# Altium schematic sheet GPIO.SchDoc
size A4; SheetNumber: 6; SheetTotal: 6
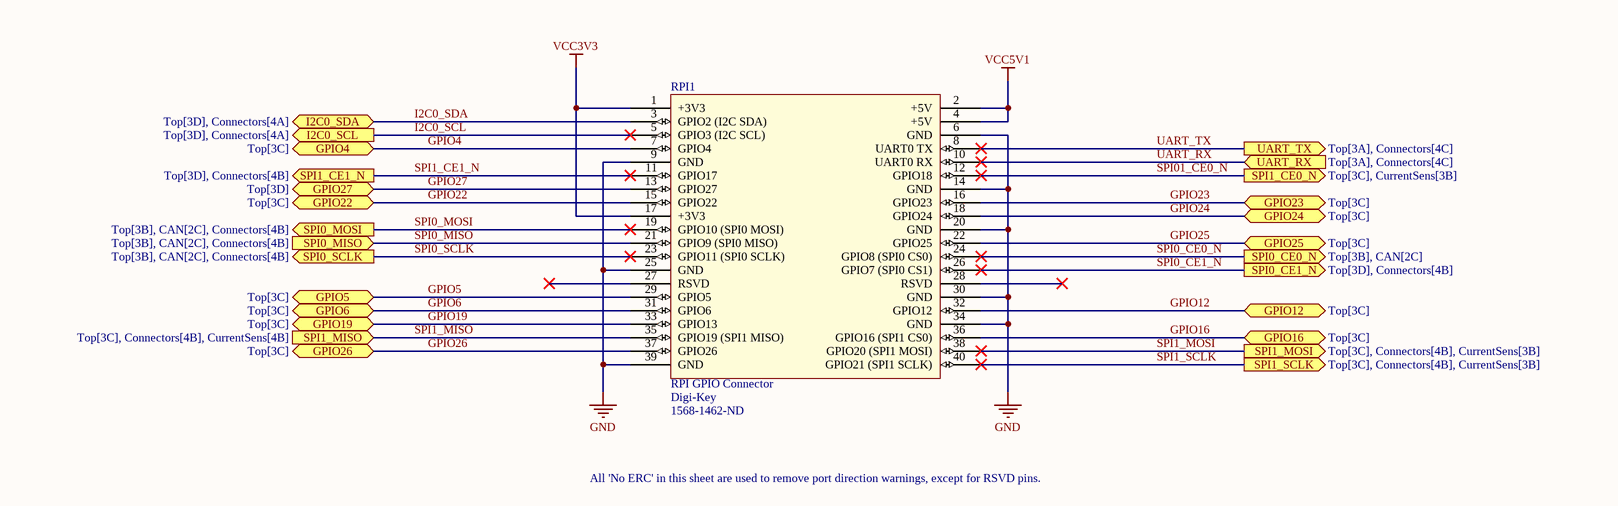
[diagram p0: GPIO.SchDoc]

## Parts
RPI1  RPI GPIO Connector  Supplier 1: Digi-Key  Supplier Part Number 1: 1568-1462-ND  [rpi]

## Ports
GPIO4 (bidir, see Top[3C]), GPIO5 (bidir, see Top[3C]), GPIO6 (bidir, see Top[3C]), GPIO12 (bidir, see Top[3C]), GPIO16 (bidir, see Top[3C]), GPIO19 (bidir, see Top[3C]), GPIO22 (bidir, see Top[3C]), GPIO23 (bidir, see Top[3C]), GPIO24 (bidir, see Top[3C]), GPIO25 (bidir, see Top[3C]), GPIO26 (bidir, see Top[3C]), GPIO27 (bidir, see Top[3D]), I2C0_SCL (out, see Top[3D], Connectors[4A]), I2C0_SDA (bidir, see Top[3D], Connectors[4A]), SPI0_CE0_N (out, see Top[3B], CAN[2C]), SPI0_CE1_N (out, see Top[3D], Connectors[4B]), SPI0_MISO (in, see Top[3B], CAN[2C], Connectors[4B]), SPI0_MOSI (out, see Top[3B], CAN[2C], Connectors[4B]), SPI0_SCLK (out, see Top[3B], CAN[2C], Connectors[4B]), SPI1_CE0_N (out, see Top[3C], CurrentSens[3B]), SPI1_CE1_N (out, see Top[3D], Connectors[4B]), SPI1_MISO (in, see Top[3C], Connectors[4B], CurrentSens[4B]), SPI1_MOSI (out, see Top[3C], Connectors[4B], CurrentSens[3B]), SPI1_SCLK (out, see Top[3C], Connectors[4B], CurrentSens[3B]), UART_RX (in, see Top[3A], Connectors[4C]), UART_TX (out, see Top[3A], Connectors[4C])

## Nets
GND: RPI1.6(GND) RPI1.9(GND) RPI1.14(GND) RPI1.20(GND) RPI1.25(GND) RPI1.30(GND) RPI1.34(GND) RPI1.39(GND)
VCC3V3: RPI1.1(+3V3) RPI1.17(+3V3)
VCC5V1: RPI1.2(+5V) RPI1.4(+5V)
GPIO4: RPI1.7(GPIO4) ; port GPIO4
GPIO5: RPI1.29(GPIO5) ; port GPIO5
GPIO6: RPI1.31(GPIO6) ; port GPIO6
GPIO12: RPI1.32(GPIO12) ; port GPIO12
GPIO16: RPI1.36(GPIO16_(SPI1_CS0)) ; port GPIO16
GPIO19: RPI1.33(GPIO13) ; port GPIO19
GPIO22: RPI1.15(GPIO22) ; port GPIO22
GPIO23: RPI1.16(GPIO23) ; port GPIO23
GPIO24: RPI1.18(GPIO24) ; port GPIO24
GPIO25: RPI1.22(GPIO25) ; port GPIO25
GPIO26: RPI1.37(GPIO26) ; port GPIO26
GPIO27: RPI1.13(GPIO27) ; port GPIO27
I2C0_SCL: RPI1.5(GPIO3_(I2C_SCL)) ; port I2C0_SCL
I2C0_SDA: RPI1.3(GPIO2_(I2C_SDA)) ; port I2C0_SDA
SPI0_CE0_N: RPI1.24(GPIO8_(SPI0_CS0)) ; port SPI0_CE0_N
SPI0_CE1_N: RPI1.26(GPIO7_(SPI0_CS1)) ; port SPI0_CE1_N
SPI0_MISO: RPI1.21(GPIO9_(SPI0_MISO)) ; port SPI0_MISO
SPI0_MOSI: RPI1.19(GPIO10_(SPI0_MOSI)) ; port SPI0_MOSI
SPI0_SCLK: RPI1.23(GPIO11_(SPI0_SCLK)) ; port SPI0_SCLK
SPI01_CE0_N: RPI1.12(GPIO18) ; port SPI1_CE0_N
SPI1_CE1_N: RPI1.11(GPIO17) ; port SPI1_CE1_N
SPI1_MISO: RPI1.35(GPIO19_(SPI1_MISO)) ; port SPI1_MISO
SPI1_MOSI: RPI1.38(GPIO20_(SPI1_MOSI)) ; port SPI1_MOSI
SPI1_SCLK: RPI1.40(GPIO21_(SPI1_SCLK)) ; port SPI1_SCLK
UART_RX: RPI1.10(UART0_RX) ; port UART_RX
UART_TX: RPI1.8(UART0_TX) ; port UART_TX

Not connected (* = marked no-connect by the designer): RPI1 27(RSVD)* 28(RSVD)*

## Notes on the sheet
- All 'No ERC' in this sheet are used to remove port direction warnings, except for RSVD pins.

## Library data of the parts
RPI1 = rpi connector: GPIO Header for Raspberry Pi A+/B+/Pi 2/Pi 3 - 2x20; Manufacturer: SparkFun Electronics; Manufacturer Part Number: PRT-14017; Nils Minor: author; nilsminor@web.de: mail; RoHS: RoHS Compliant; Category: Development Boards, Kits, Programmers; Stock 1: 150; Pricing 1: 1=1.84 (EUR); Part Status: Active; Accessory Type: Connector; For Use With/Related Products: Raspberry Pi; ComponentLink1URL: https://cdn.sparkfun.com/datasheets/Dev/RaspberryPi/12313.pdf; ComponentLink1Description: https://cdn.sparkfun.com/datasheets/Dev/RaspberryPi/12313.pdf